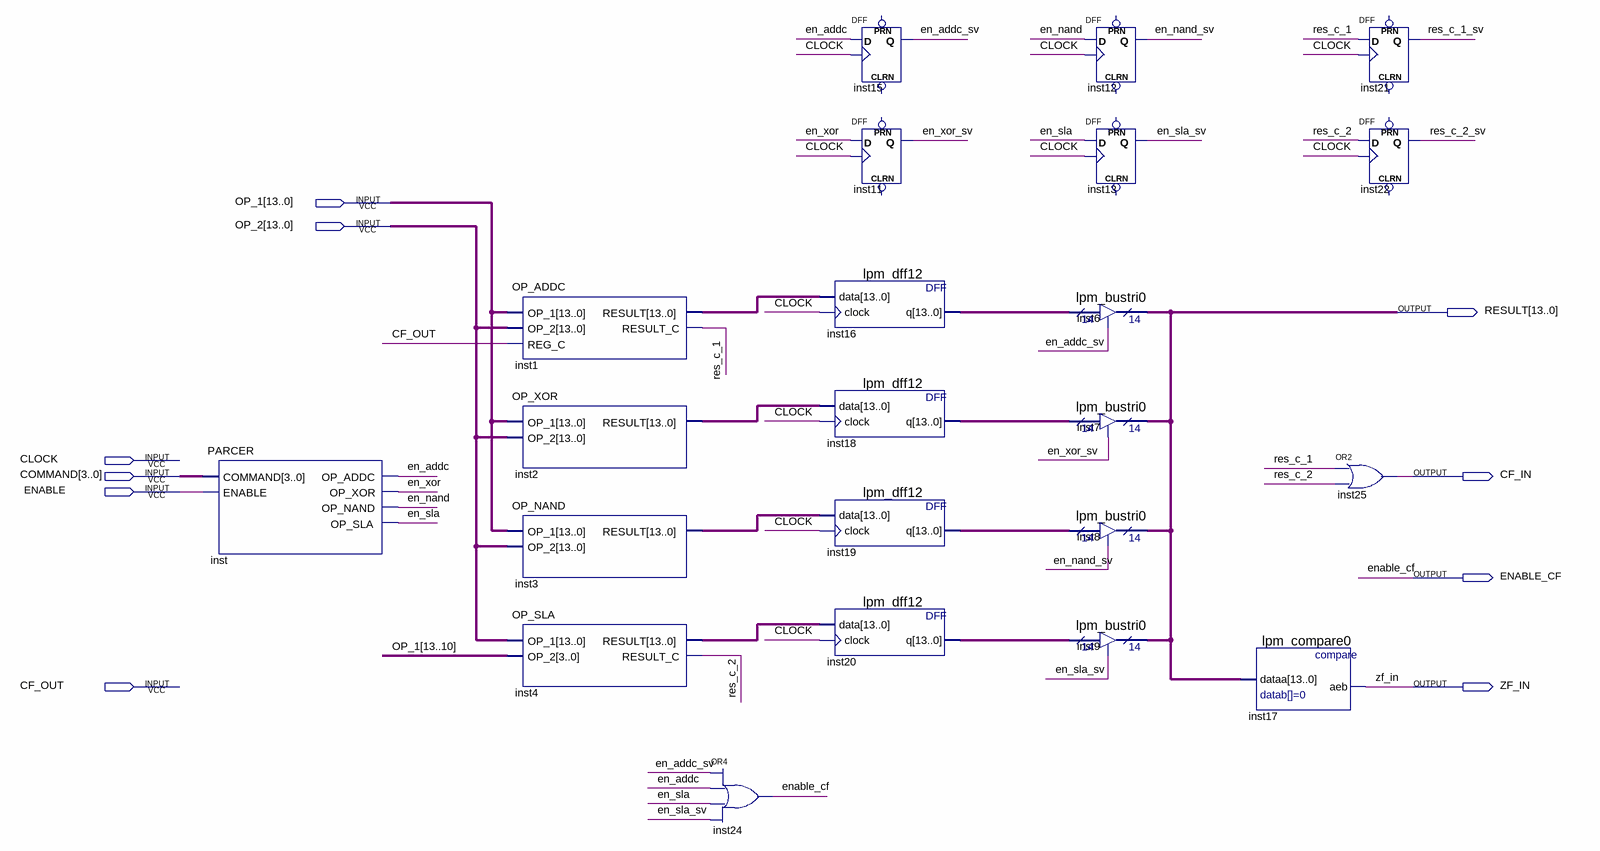
[diagram p0: schematic sheet]
// Quartus schematic ALU.bdf as structural Verilog: 22 symbols, 10 pins
module ALU (
  input  [13:0] OP_1,
  input  [13:0] OP_2,
  input  CLOCK,
  input  [3:0] COMMAND,
  input  ENABLE,
  input  CF_OUT,
  output [13:0] RESULT,
  output CF_IN,
  output ENABLE_CF,
  output ZF_IN
);

  wire en_addc, en_addc_sv, en_nand, en_nand_sv, en_sla, en_sla_sv, en_xor, en_xor_sv, res_c_1, res_c_1_sv,
       res_c_2, res_c_2_sv;
  wire [13:0] inst1_result, inst2_result, inst3_result, inst4_result, inst16_q, inst18_q, inst19_q, inst20_q;

  PARCER inst (
    .COMMAND(COMMAND), .ENABLE(ENABLE), .OP_ADDC(en_addc), .OP_XOR(en_xor), .OP_NAND(en_nand), .OP_SLA(en_sla));
  OP_ADDC inst1 (.OP_1(OP_1), .OP_2(OP_2), .REG_C(CF_OUT), .RESULT(inst1_result), .RESULT_C(res_c_1));
  OP_XOR inst2 (.OP_1(OP_1), .OP_2(OP_2), .RESULT(inst2_result));
  OP_NAND inst3 (.OP_1(OP_1), .OP_2(OP_2), .RESULT(inst3_result));
  OP_SLA inst4 (.OP_1(OP_2), .OP_2(OP_1[13:10]), .RESULT(inst4_result), .RESULT_C(res_c_2));
  or inst24 (ENABLE_CF, en_addc_sv, en_addc, en_sla, en_sla_sv);
  lpm_dff12 inst16 (.data(inst1_result), .clock(CLOCK), .q(inst16_q));
  lpm_dff12 inst18 (.data(inst2_result), .clock(CLOCK), .q(inst18_q));
  lpm_dff12 inst19 (.data(inst3_result), .clock(CLOCK), .q(inst19_q));
  lpm_dff12 inst20 (.data(inst4_result), .clock(CLOCK), .q(inst20_q));
  DFF inst15 (.CLK(CLOCK), .D(en_addc), .Q(en_addc_sv));  // open: CLRN, PRN
  DFF inst11 (.CLK(CLOCK), .D(en_xor), .Q(en_xor_sv));  // open: CLRN, PRN
  DFF inst12 (.CLK(CLOCK), .D(en_nand), .Q(en_nand_sv));  // open: CLRN, PRN
  DFF inst13 (.CLK(CLOCK), .D(en_sla), .Q(en_sla_sv));  // open: CLRN, PRN
  lpm_bustri0 inst6 (.enabledt(en_addc_sv), .data(inst16_q), .tridata(RESULT));
  lpm_bustri0 inst7 (.enabledt(en_xor_sv), .data(inst18_q), .tridata(RESULT));
  lpm_bustri0 inst8 (.enabledt(en_nand_sv), .data(inst19_q), .tridata(RESULT));
  lpm_bustri0 inst9 (.enabledt(en_sla_sv), .data(inst20_q), .tridata(RESULT));
  lpm_compare0 inst17 (.dataa(RESULT), .aeb(ZF_IN));
  or inst25 (CF_IN, res_c_1, res_c_2);
  DFF inst21 (.CLK(CLOCK), .D(res_c_1), .Q(res_c_1_sv));  // open: CLRN, PRN
  DFF inst22 (.CLK(CLOCK), .D(res_c_2), .Q(res_c_2_sv));  // open: CLRN, PRN
endmodule
